# EAGLE board SCH1001-001-009-320 - ALU (EAGLE 9.4.2), part 1 of 4
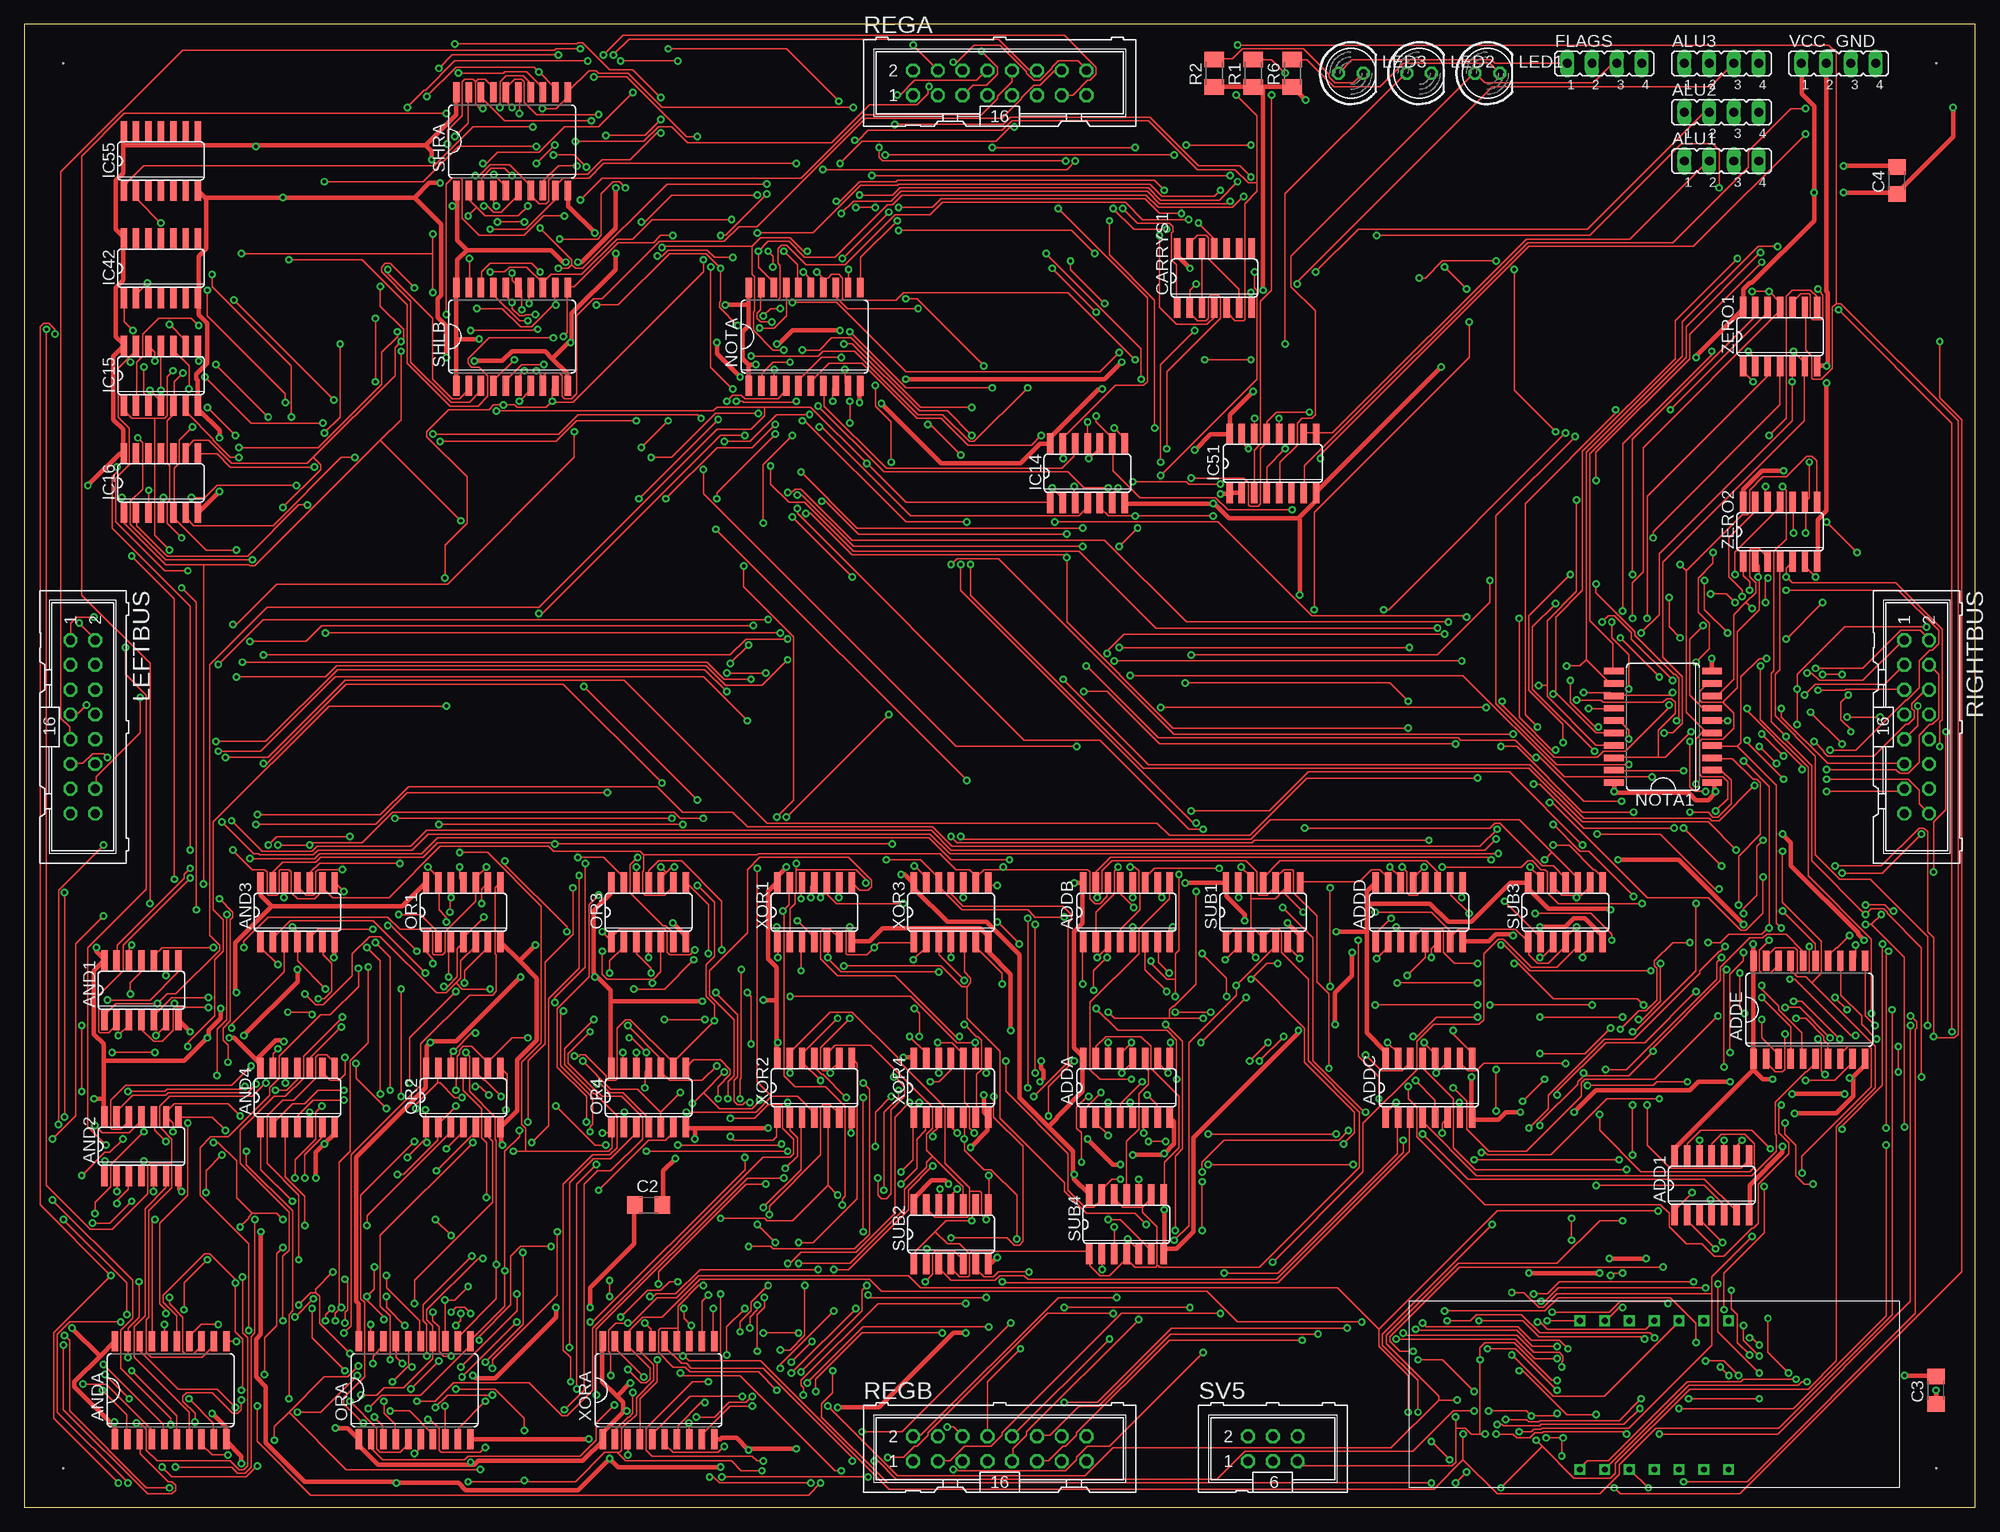
[diagram p5: board, top side]
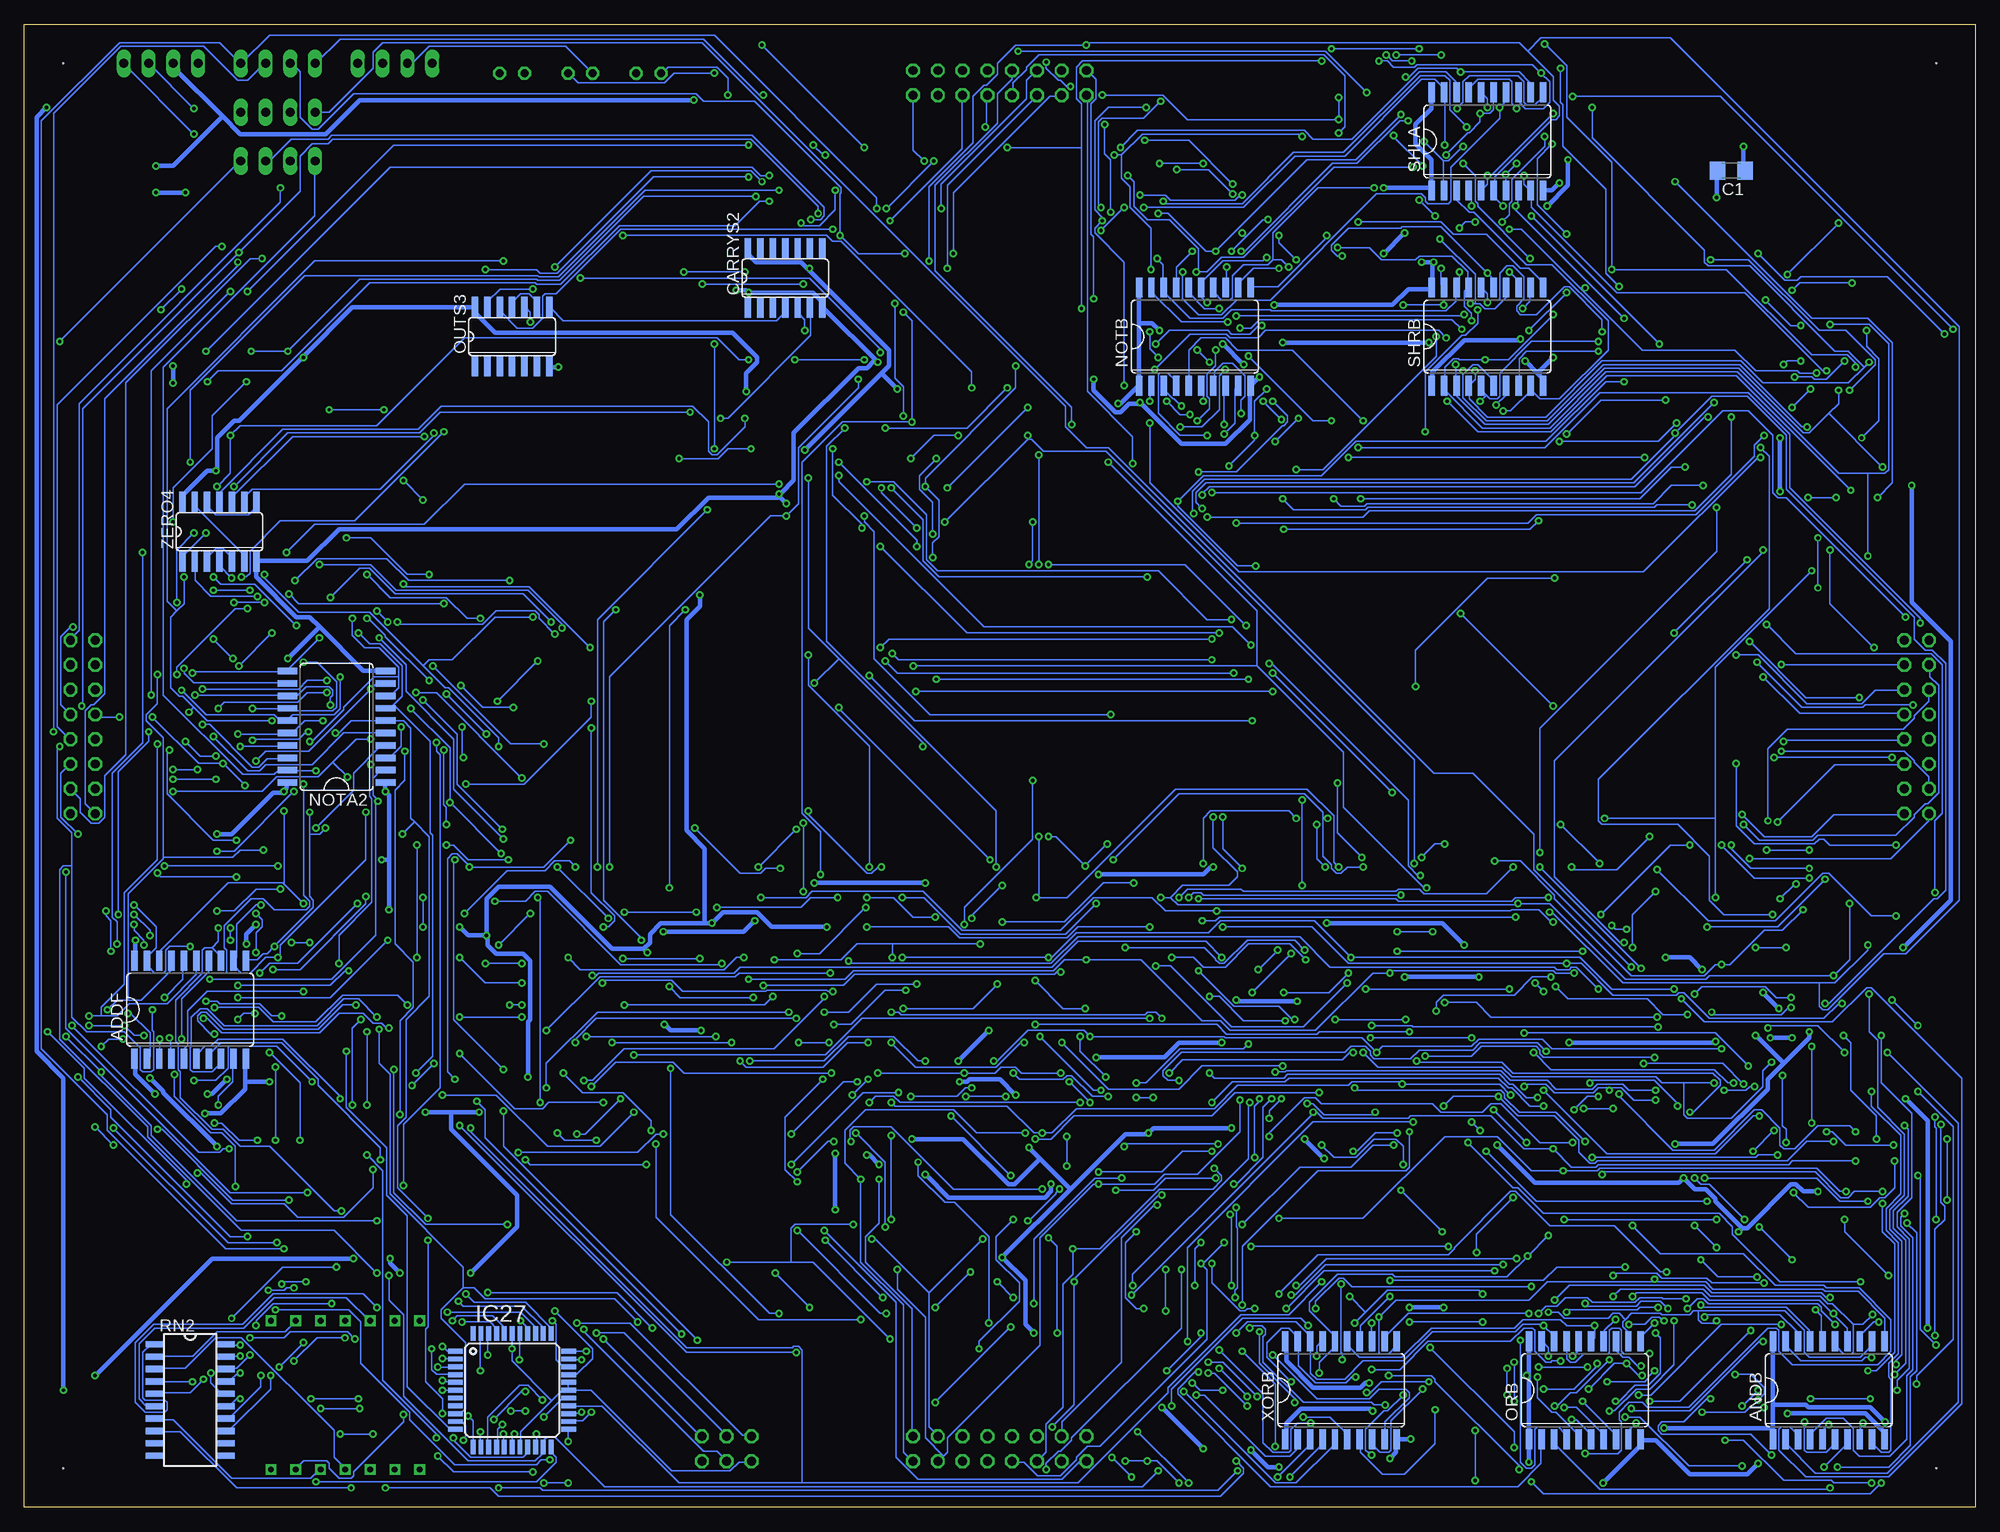
[diagram p6: board, bottom side, seen from below]

Size 200 x 152 mm. Coordinates in mm from the lower left corner, seen from the top.
Outline: 0,0 200,0 200,152 0,152 0,0
Copper layers (1*16): Top 0.035mm / dielectric 1.5mm / Bottom 0.035mm
Design rules "default *": minimum track width 6mil, minimum drill 0.35mm, track to track 6mil, track to pad 6mil, pad to pad 6mil, via to via 6mil, smd to smd 6mil, copper to edge 40mil, drill to drill 6mil, minimum pad ring 10mil, minimum via ring 8mil, stop-mask expansion 4mil, vias tented up to drill 0mil, thermal gap 10mil
Net classes: 1 power: width 0.457 mm
Holes 0.12 mm at 4,4 196,148 4,148 196,4

## Footprints (pad centres in the part's own frame; a part is rotated, then mirrored left to right if it is on the bottom)
SO14 = smd 0.66 x 2.032: 1 -3.81,-3.073; 2 -2.54,-3.073; 3 -1.27,-3.073; 4 0,-3.073; 5 1.27,-3.073; 6 2.54,-3.073; 7 3.81,-3.073; 8 3.81,3.073; 9 2.54,3.073; 10 1.27,3.073; 11 0,3.073; 12 -1.27,3.073; 13 -2.54,3.073; 14 -3.81,3.073
SO16 = smd 0.66 x 2.032: 1 -4.445,-3.073; 2 -3.175,-3.073; 3 -1.905,-3.073; 4 -0.635,-3.073; 5 0.635,-3.073; 6 1.905,-3.073; 7 3.175,-3.073; 8 4.445,-3.073; 9 4.445,3.073; 10 3.175,3.073; 11 1.905,3.073; 12 0.635,3.073; 13 -0.635,3.073; 14 -1.905,3.073; 15 -3.175,3.073; 16 -4.445,3.073
SO20W = smd 0.66 x 2.032: 1 -5.715,-5.029; 2 -4.445,-5.029; 3 -3.175,-5.029; 4 -1.905,-5.029; 5 -0.635,-5.029; 6 0.635,-5.029; 7 1.905,-5.029; 8 3.175,-5.029; 9 4.445,-5.029; 10 5.715,-5.029; 11 5.715,5.029; 12 4.445,5.029; 13 3.175,5.029; 14 1.905,5.029; 15 0.635,5.029; 16 -0.635,5.029; 17 -1.905,5.029; 18 -3.175,5.029; 19 -4.445,5.029; 20 -5.715,5.029
JP4 = drill 0.914 long: 1 -3.81,0; 2 -1.27,0; 3 1.27,0; 4 3.81,0
C1206 = smd 1.6 x 1.8: 1 -1.4,0; 2 1.4,0
TQFP44 = smd 1.5 x 0.5: 1 -5.8,4; 2 -5.8,3.2; 3 -5.8,2.4; 4 -5.8,1.6; 5 -5.8,0.8; 6 -5.8,0; 7 -5.8,-0.8; 8 -5.8,-1.6; 9 -5.8,-2.4; 10 -5.8,-3.2; 11 -5.8,-4; 23 5.8,-4; 24 5.8,-3.2; 25 5.8,-2.4; 26 5.8,-1.6; 27 5.8,-0.8; 28 5.8,0; 29 5.8,0.8; 30 5.8,1.6; 31 5.8,2.4; 32 5.8,3.2; 33 5.8,4 | smd 0.5 x 1.5: 12 -4,-5.8; 13 -3.2,-5.8; 14 -2.4,-5.8; 15 -1.6,-5.8; 16 -0.8,-5.8; 17 0,-5.8; 18 0.8,-5.8; 19 1.6,-5.8; 20 2.4,-5.8; 21 3.2,-5.8; 22 4,-5.8; 34 4,5.8; 35 3.2,5.8; 36 2.4,5.8; 37 1.6,5.8; 38 0.8,5.8; 39 0,5.8; 40 -0.8,5.8; 41 -1.6,5.8; 42 -2.4,5.8; 43 -3.2,5.8; 44 -4,5.8
LED5MM = drill 0.813 octagon: A -1.27,0; K 1.27,0
ML16 = drill 0.914 octagon: 1 -8.89,-1.27; 2 -8.89,1.27; 3 -6.35,-1.27; 4 -6.35,1.27; 5 -3.81,-1.27; 6 -3.81,1.27; 7 -1.27,-1.27; 8 -1.27,1.27; 9 1.27,-1.27; 10 1.27,1.27; 11 3.81,-1.27; 12 3.81,1.27; 13 6.35,-1.27; 14 6.35,1.27; 15 8.89,-1.27; 16 8.89,1.27
M1206 = smd 1.6 x 2: 1 -1.4,0; 2 1.4,0
SOMC20 = smd 1.91 x 0.64: 1 -3.62,5.715; 2 -3.62,4.445; 3 -3.62,3.175; 4 -3.62,1.905; 5 -3.62,0.635; 6 -3.62,-0.635; 7 -3.62,-1.905; 8 -3.62,-3.175; 9 -3.62,-4.445; 10 -3.62,-5.715; 11 3.62,-5.715; 12 3.62,-4.445; 13 3.62,-3.175; 14 3.62,-1.905; 15 3.62,-0.635; 16 3.62,0.635; 17 3.62,1.905; 18 3.62,3.175; 19 3.62,4.445; 20 3.62,5.715
ML6 = drill 0.914 octagon: 1 -2.54,-1.27; 2 -2.54,1.27; 3 0,-1.27; 4 0,1.27; 5 2.54,-1.27; 6 2.54,1.27
4-DIGIT-7-SEGMENT = drill 0.6 square: PIN1 17.48,1.88; PIN2 20.02,1.88; PIN3 22.56,1.88; PIN4 25.1,1.88; PIN5 27.64,1.88; PIN6 30.18,1.88; PIN7 32.72,1.88; PIN8 32.72,17.12; PIN9 30.18,17.12; PIN10 27.64,17.12; PIN11 25.1,17.12; PIN12 22.56,17.12; PIN13 20.02,17.12; PIN14 17.48,17.12

## Placement (x,y rotation side)
ADD1  74ALS08D  [SO14]  173,33 0 top
ADDA  74283D  [SO16]  113,43 0 top
ADDB  74283D  [SO16]  113,61 0 top
ADDC  74283D  [SO16]  144,43 0 top
ADDD  74283D  [SO16]  143,61 0 top
ADDE  74AC245DW  [SO20W]  183,51 0 top
ADDF  74AC245DW  [SO20W]  183,51 0 bottom
ALU1  [JP4]  174,138 0 top
ALU2  [JP4]  174,143 0 top
ALU3  [JP4]  174,148 0 top
AND1  74ALS08D  [SO14]  12,53 0 top
AND2  74ALS08D  [SO14]  12,37 0 top
AND3  74ALS08D  [SO14]  28,61 0 top
AND4  74ALS08D  [SO14]  28,42 0 top
ANDA  74AC245DW  [SO20W]  15,12 0 top
ANDB  74AC245DW  [SO20W]  15,12 0 bottom
C1  1uF  [C1206]  25,137 180 bottom
C2  1uF  [C1206]  64,31 0 top
C3  1uF  [C1206]  196,12 90 top
C4  1uF  [C1206]  192,136 90 top
CARRYS1  74ALS08D  [SO14]  122,126 0 top
CARRYS2  74ALS08D  [SO14]  122,126 0 bottom
FLAGS  [JP4]  162,148 0 top
IC14  74ALS04D  [SO14]  109,106 0 top
IC15  74ALS04D  [SO14]  14,116 0 top
IC16  74ALS04D  [SO14]  14,105 0 top
IC27  MEGA8535-A  [TQFP44]  150,12 0 bottom
IC42  74ALS04D  [SO14]  14,127 0 top
IC51  74LS173D  [SO16]  128,107 0 top
IC55  74ALS04D  [SO14]  14,138 0 top
LED1  [LED5MM]  150,147 0 top
LED2  [LED5MM]  143,147 0 top
LED3  [LED5MM]  136,147 0 top
LEFTBUS  [ML16]  6,80 270 top
NOTA  74AC245DW  [SO20W]  80,120 0 top
NOTA1  74AC245DW  [SO20W]  168,80 90 top
NOTA2  74AC245DW  [SO20W]  168,80 90 bottom
NOTB  74AC245DW  [SO20W]  80,120 0 bottom
OR1  74LS32D  [SO14]  45,61 0 top
OR2  74LS32D  [SO14]  45,42 0 top
OR3  74LS32D  [SO14]  64,61 0 top
OR4  74LS32D  [SO14]  64,42 0 top
ORA  74AC245DW  [SO20W]  40,12 0 top
ORB  74AC245DW  [SO20W]  40,12 0 bottom
OUTS3  74LS32D  [SO14]  150,120 0 bottom
R1  [M1206]  126,147 90 top
R2  [M1206]  122,147 90 top
R6  [M1206]  130,147 90 top
REGA  [ML16]  100,146 0 top
REGB  [ML16]  100,6 0 top
RIGHTBUS  [ML16]  194,80 270 top
RN2  [SOMC20]  183,11 0 bottom
SHLA  74AC245DW  [SO20W]  50,140 0 bottom
SHLB  74AC245DW  [SO20W]  50,120 0 top
SHRA  74AC245DW  [SO20W]  50,140 0 top
SHRB  74AC245DW  [SO20W]  50,120 0 bottom
SUB1  74LS86D  [SO14]  127,61 0 top
SUB2  74LS86D  [SO14]  95,28 0 top
SUB3  74LS86D  [SO14]  158,61 0 top
SUB4  74LS86D  [SO14]  113,29 0 top
SV5  [ML6]  128,6 0 top
U$1  4-DIGIT-7-SEGMENT  [4-DIGIT-7-SEGMENT]  142,2 0 top
VCC_GND  [JP4]  186,148 0 top
XOR1  74LS86D  [SO14]  81,61 0 top
XOR2  74LS86D  [SO14]  81,43 0 top
XOR3  74LS86D  [SO14]  95,61 0 top
XOR4  74LS86D  [SO14]  95,43 0 top
XORA  74AC245DW  [SO20W]  65,12 0 top
XORB  74AC245DW  [SO20W]  65,12 0 bottom
ZERO1  74ALS02D  [SO14]  180,120 0 top
ZERO2  74ALS02D  [SO14]  180,100 0 top
ZERO4  74ALS08D  [SO14]  180,100 0 bottom

## Tracks (layer width: path | path; a pad name or v marks a point on that pad's centre or on a via)
!ADD  (via drill 0.35)
  Top 0.152: v173.38,26.5 170.5,29.38 170.5,29.88 ADD1.2 | v112.62,133.12 114.12,131.62 117.38,131.62 117.75,131.25 117.75,130.75 117.62,130.62 117.62,127.88 118.12,127.38 118.12,123 CARRYS1.1
  Bottom 0.152: v173.38,26.5 179.38,26.5 191.5,38.62 191.5,40.25 198.25,47 198.25,142.12 190.25,150.12 180,150.12 177.88,148 ALU3.4 177.75,148 174.88,150.88 129.25,150.88 112.62,134.25 v112.62,133.12
!ALUOUT  (via drill 0.35)
  Top 0.152: v170.12,75.5 163,75.5 NOTA1.19
  Bottom 0.152: v170.12,75.5 173,75.5 NOTA2.19 173.12,75.5 174,75.5 174.38,75.12 177.62,75.12 185.75,83.25 185.75,116.88 170.25,132.38 170.25,138 ALU1.1
!AND  (via drill 0.35)
  Top 0.152: v10.62,15.38 10.62,17 ANDA.19 10.62,17.12 10.62,18.38 11.75,19.5 v11.75,23.12 | ALU2.2 172.25,143 160.25,131 136.75,131 v132.38,126.62 | v126.12,126.62 126.12,125 126.38,124.75 126.38,115.62 v116.5,105.75 | v72.38,86.5 v74.25,88.38 | v56.88,64.75 56.88,55.25 53.75,52.12 53.75,39.12 v52,37.38
  Bottom 0.152: v10.62,15.38 11.25,15.38 11.62,15 17.88,15 19.38,16.5 19.38,17 ANDB.19 | v126.12,126.62 v132.38,126.62 | v116.5,105.75 116.5,105.12 101.62,90.25 76.12,90.25 v74.25,88.38 | v72.38,86.5 72.12,86.5 58.12,72.5 58.12,65.75 57.12,64.75 v56.88,64.75 | v52,37.38 47.38,32.75 46.88,32.75 44.25,30.12 26.25,30.12 24.88,28.75 24.88,28 20,23.12 v11.75,23.12
!FLAG_IN
  Top 0.152: IC51.10 131.25,110.12 132.38,110.12 IC51.9 132.5,110.12 134.12,110.12 154,130 164.62,130 172.62,138 ALU1.2
!NOT  (via drill 0.35)
  Top 0.152: 75.5,123.75 75.5,122.75 75.12,122.38 75.12,121.88 75.5,121.5 v76.62,121.5 | 75.5,123.75 75.5,125 NOTA.19 | v119.38,132 114.62,132 112.88,133.75 94.12,133.75 92.88,132.5 89.25,132.5 84.12,127.38 80.12,127.38 78.12,129.38 77.62,129.38 77.25,129 77.25,127.5 77.5,127.25 77.5,124 77.25,123.75 75.5,123.75
  Bottom 0.152: v76.62,121.5 81.38,121.5 84.38,124.5 84.38,125 NOTB.19 | ALU1.3 174.88,138 172.62,140.25 168.88,140.25 168.5,140.62 125.38,140.62 118,133.25 118,132.38 118.38,132 v119.38,132
!OR  (via drill 0.35)
  Top 0.152: v35.5,18.75 35.5,17.12 ORA.19 | v31.88,19.12 31.88,19.88 v32.5,20.5 32.25,20.75 32.25,35.38 33.38,36.5 33.38,45.75 35.25,47.62 v35.25,55.38 | v41.88,20 41.88,19.12 42.5,18.5 42.5,16 43,15.5 v43.75,15.5
  Bottom 0.152: v35.5,18.75 33.88,18.75 33.12,19.5 32.38,19.5 32,19.12 v31.88,19.12 | v32.5,20.5 34.38,20.5 34.62,20.25 41.62,20.25 v41.88,20 | v43.75,15.5 43.75,16.38 44.38,17 ORB.19 | ALU2.1 168.75,143 164.25,147.5 164.25,149.12 163.25,150.12 130.5,150.12 93.25,112.88 93.25,110.75 91.12,108.62 88.88,108.62 55.5,75.25 51.5,75.25 45.25,69 45.25,65.38 v35.25,55.38
!SHL  (via drill 0.35)
  Top 0.152: v45.62,128 45.62,125.12 SHLB.19 | v54.38,139.62 v52.5,137.75 | CARRYS1.4 122,122 121.25,121.25 118.12,121.25 116.38,123 v116.38,130.38 | v87.25,133.25 v85.25,133.25 | v89.62,130.88 107.38,130.88 v109.75,128.5
  Bottom 0.152: v45.62,128 51,133.38 51,133.62 51.25,133.88 51.25,136.5 v52.5,137.75 | v54.38,139.62 54.38,145 SHLA.19 54.5,145.12 54.5,145.5 55.38,146.38 56.75,146.38 64.62,138.5 69.75,138.5 75,133.25 v85.25,133.25 | ALU3.2 172.62,148 171.75,147.12 171.75,142.5 170.5,141.25 169.88,141.25 166.25,144.88 131.12,144.88 130.38,144.12 125.12,144.12 116.25,135.25 116.25,134.75 116.38,134.62 v116.38,130.38 114.5,128.5 v109.75,128.5 | v89.62,130.88 v87.25,133.25
!SHR  (via drill 0.35)
  Top 0.152: v44.12,140.5 45.5,141.88 45.5,145 SHRA.19 | v51.25,131.75 v48.5,131.75 | v52.88,131.12 56.12,127.88 56.12,127.38 | 56.12,127.38 55.75,127 v54.75,127 | 126.38,135.75 126.38,142.62 v124.25,144.75 | 126.38,135.75 126.38,134.88 125.12,133.62 125.12,121.75 125,121.62 124.12,121.62 123.38,122.38 123.38,122.88 CARRYS1.5 | 56.12,127.38 56.5,127 57.25,127 65.88,135.62 v76.12,135.62 | v85.12,140.12 85.5,140.12 86.5,141.12 100.25,141.12 101.25,142.12 115.25,142.12 120.25,137.12 124.12,137.12 125.5,135.75 126.38,135.75
  Bottom 0.152: v44.12,140.5 44.12,139.5 47.5,136.12 47.5,133.88 47.75,133.62 47.75,132.5 v48.5,131.75 | v51.25,131.75 52.25,131.75 v52.88,131.12 | v54.75,127 54.75,125.38 54.5,125.12 SHRB.19 | v124.25,144.75 124.62,144.75 130.38,150.5 167.62,150.5 170.12,148 ALU3.1 | v76.12,135.62 80.62,140.12 v85.12,140.12
!SUB  (via drill 0.35)
  Top 0.152: v120.12,125.38 119.5,124.75 119.5,123 CARRYS1.2 119.5,122.88 119.5,122.38 120.25,121.62 121.12,121.62 121.38,121.88 121.38,124 121.62,124.25 122.38,124.25 122.62,124 122.62,121.88 117.12,116.38 v117.12,108.5 | v130.5,125.38 130.5,125.62 150.5,145.62 172.88,145.62 175.25,148 ALU3.3 | v171,32.25 169.25,30.5 169.25,30 ADD1.1 | v195.75,65.12 195.75,70.25 197,71.5 v197,79.5 | v11.12,120.62 10.25,121.5 10.25,123.88 IC42.1 | v11.62,109.62 12.12,109.12 12.12,104.38 10.88,103.12 10.88,100.75 14.5,97.12 v23.38,97.12 | v77.5,89.62 v30.88,89.62 | v114.12,100.38 v112.25,98.5
  Bottom 0.152: v130.5,125.38 v120.12,125.38 | v171,32.25 178.88,32.25 195.75,49.12 v195.75,65.12 | v197,79.5 197,142.88 190.12,149.75 181.62,149.75 178.12,146.25 177.12,146.25 175.38,148 ALU3.3 | v11.12,120.62 11.12,119 9.88,117.75 9.88,111.38 v11.62,109.62 | v30.88,89.62 v23.38,97.12 | v77.5,89.62 103.38,89.62 v112.25,98.5 | v114.12,100.38 114.12,100.75 117.12,103.75 v117.12,108.5
!XOR  (via drill 0.35)
  Top 0.152: v63.5,13.38 60.62,16.25 60.62,17 XORA.19 | v196.38,119.5 196.38,113.75 198.62,111.5 198.62,24.12 175.88,1.38 163.62,1.38 v163,2 | v75.75,4.75 75.12,4.75 74.62,5.25 64.38,5.25 63.75,5.88 63.75,8.12 68.5,12.88 v70.12,12.88
  Bottom 0.152: v63.5,13.38 63.88,13.38 64.5,12.75 67.62,12.75 69.38,14.5 69.38,17 XORB.19 69.5,17.12 69.5,17.5 70.38,18.38 71.12,18.38 72.62,16.88 72.62,15.38 v70.12,12.88 | v196.38,119.5 177.88,138 ALU1.4 | v163,2 152.25,2 151.38,1.12 77.38,1.12 75,3.5 75,4 v75.75,4.75
A  (via drill 0.35)
  Top 0.152: v149.12,19.12 153.62,19.12 155.25,17.5 165.88,17.5 v166.12,17.25 | v176.88,17.38 177.12,17.38 v177.88,16.62
  Bottom 0.152: v149.12,19.12 148.5,18.5 148.5,17.88 IC27.37 | v166.12,17.25 166.88,18 172.75,18 173.38,17.38 v176.88,17.38 | v177.88,16.62 179.38,16.62 RN2.20
ADD_CARRY  (via drill 0.35)
  Top 0.152: v117.5,47.62 117.5,46.12 ADDA.9 | v125.25,52.25 v120.62,47.62 | v133.88,63.5 v133.88,53.38 | v132.25,92 132.25,102 148.12,117.88 v148.12,121.5
  Bottom 0.152: v120.62,47.62 v117.5,47.62 | v125.25,52.25 132.75,52.25 v133.88,53.38 | v133.88,63.5 133.88,90.38 v132.25,92 | v148.12,121.5 148.12,122.5 148.62,123 OUTS3.10
B  (via drill 0.35)
  Top 0.152: v156.62,20 162.5,20 163.62,21.12 168.25,21.12 v168.5,20.88 | v176.25,18.62 176.25,17.12 v177.88,15.5
  Bottom 0.152: v156.62,20 149.12,20 147.62,18.5 147.62,17.88 IC27.36 | v168.5,20.88 174.5,20.88 176.25,19.12 v176.25,18.62 | v177.88,15.5 179.38,15.5 RN2.19
BUSOUT0  (via drill 0.35)
  Top 0.152: v21.62,10.25 19.75,12.12 15.75,12.12 11.88,16 11.88,17 ANDA.18 | v28,9.75 30.38,9.75 v34.12,13.5 | v35.75,14.75 35.75,15.5 36.75,16.5 36.75,17 ORA.18 | v137.12,19 124.38,19 121.25,22.12 87.88,22.12 86.62,23.38 69.25,23.38 65.38,19.5 63.38,19.5 61.88,18 61.88,17.12 XORA.18 61.88,17 61.88,16.5 64.12,14.25 64.12,13.12 63.75,12.75 63.25,12.75 v61.88,14.12 | v42.5,15 v39.62,12.12 | v58.12,142.12 49.25,142.12 46.88,144.5 46.88,145 SHRA.18 | NOTA.18 76.75,125.12 76.75,125.62 75.25,127.12 v75.25,128.75 76.25,129.75 78.38,129.75 80,128.12 83.12,128.12 88.5,133.5 89,133.5 90,134.5 115,134.5 116.25,133.25 123.88,133.25 v125,134.38 | v176.25,76.5 178.88,73.88 178.88,59.5 | v178.88,58.12 177.88,57.12 177.88,55 178.12,54.75 179,54.75 179.75,55.5 179.75,56 ADDE.18 | v176.75,118.5 177.38,117.88 177.38,117 ZERO1.2 | v173,118.5 173,118.12 163.88,109 v163.88,91.88 | v162.75,90.75 162.75,89.12 164.5,87.38 v164.5,83.88 | v163.62,49 165.5,50.88 166.25,50.88 167.38,52 167.38,55.25 167.12,55.5 167.12,56 169,57.88 v170.75,57.88 | v172.62,57.88 173.88,57.88 174.75,58.75 178.12,58.75 178.88,59.5 | 178.88,59.5 v178.88,59.38
  Bottom 0.152: v21.62,10.25 23.12,10.25 23.62,9.75 v28,9.75 | v34.12,13.5 34.5,13.5 v35.75,14.75 37,14.75 v39.62,12.12 | 155,22.5 157.25,20.25 157.25,19.38 154.75,16.88 154.75,10.12 155.25,9.62 155.75,9.62 IC27.9 | 155,22.5 153.88,22.5 152.75,21.38 139.5,21.38 v137.12,19 | v42.5,15 43.38,15 43.5,14.88 44,14.88 45.12,16 45.12,18.12 45.38,18.38 46.25,18.38 47.62,17 56.12,17 59,14.12 v61.88,14.12 | v58.12,142.12 59,142.12 63.38,137.75 65.88,137.75 74.88,128.75 v75.25,128.75 | v176.25,76.5 175.25,77.5 170.88,77.5 v164.5,83.88 164,84.38 163,84.38 NOTA2.9 | v178.88,58.12 v178.88,59.38 | v176.75,118.5 v173,118.5 165.62,125.88 147.5,125.88 147.38,125.75 145.12,125.75 136.5,134.38 v125,134.38 | v162.75,90.75 v163.88,91.88 | 155,22.5 155,24.62 162.5,32.12 162.5,44.38 163.62,45.5 v163.62,49 | v172.62,57.88 v170.75,57.88
BUSOUT1  (via drill 0.35)
  Top 0.152: v166.38,91.12 166.38,103.62 178.62,115.88 178.62,116.88 ZERO1.3 | 155.62,6.25 158.88,3 162.62,3 163.12,3.5 163.12,4.5 170.75,12.12 182.88,12.12 185.75,15 185.75,39 189.75,43 189.75,47.25 183.25,53.75 | 155.62,6.25 v155,6.88 | 183.25,53.75 182.62,54.38 181.75,54.38 181.12,55 181.12,56 ADDE.17 | v170.75,78.5 170.75,73.88 171.25,73.38 v172.38,73.38 | v180.25,67.25 180.25,62 184.25,58 184.25,54.75 183.25,53.75 | 46.25,146.12 46.5,146.38 47.25,146.38 48,145.62 48,145.12 SHRA.17 | 46.25,146.12 46.25,143.88 46.75,143.38 v47,143.38 | v75.38,120.88 76.88,120.88 78.12,122.12 78.12,125 NOTA.17 | v52.62,120.75 52.25,120.75 52.12,120.62 v45.75,120.62 | v41.88,130.5 41.88,128.5 | 41.88,128.5 v41.88,124.5 | v43.38,139.75 43.38,141.12 44.88,142.62 44.88,146.12 45.12,146.38 46,146.38 46.25,146.12 | v13.38,29.5 13.12,29.25 13.12,17.12 ANDA.17 | v9.62,2.5 3,9.12 3,17.88 v8.88,23.75 1.62,31 1.62,121 2,121.38 2.5,121.38 3.12,120.75 v3.12,120.25 | 51.25,2.62 56.5,2.62 59.5,5.62 60.75,5.62 | 51.25,2.62 v45.5,2.62 | 60.75,5.62 61,5.62 61.25,5.88 61.25,8.12 62,8.88 62.12,8.88 62.75,9.5 62.75,11.25 64.5,13 64.5,14.62 63.12,16 63.12,17 XORA.17 | v38.75,14.75 38.12,15.38 38.12,17 ORA.17 | v44.25,12.12 48.25,12.12 51.25,9.12 v51.25,7.88 | 51.25,2.62 v51.25,2.75 | v22.25,128.5 41.88,128.5 | v151.38,2 155.62,6.25 | v75.62,3.75 73.5,3.75 72.5,4.75 61.62,4.75 60.75,5.62
  Bottom 0.152: 161.62,85.12 161.62,86.12 163.62,88.12 165.12,88.12 166.38,89.38 v166.38,91.12 | 161.62,85.12 161.62,84 162.38,83.25 162.88,83.25 NOTA2.8 | v155,6.88 154.75,7.12 154.75,8.38 155.12,8.75 155.75,8.75 IC27.10 | 161.62,85.12 164.12,85.12 167.25,82 167.25,81.75 170.5,78.5 v170.75,78.5 | v172.38,73.38 178.5,67.25 v180.25,67.25 | v47,143.38 47.5,143.88 47.5,146.12 47.75,146.38 51,146.38 51.88,145.5 51.88,145.12 SHLA.17 | v75.38,120.88 74.25,120.88 73.38,121.75 53.62,121.75 v52.62,120.75 | v41.88,124.5 v45.75,120.62 | v41.88,130.5 44.88,133.5 44.88,138.25 v43.38,139.75 | v13.38,29.5 13.38,28.25 v8.88,23.75 | v9.62,2.5 10.75,1.38 44.25,1.38 v45.5,2.62 | v38.75,14.75 38.75,14.5 41.12,12.12 v44.25,12.12 | v51.25,2.75 v51.25,7.88 | v22.25,128.5 19.5,125.75 18.25,125.75 17.88,126.12 9,126.12 v3.12,120.25 | v151.38,2 147.12,2 146.88,1.75 77.62,1.75 v75.62,3.75
BUSOUT2  (via drill 0.35)
  Top 0.152: v50,143.5 49.38,144.12 49.38,145 SHRA.16 49.38,145.12 49.38,145.5 50.25,146.38 51,146.38 51.25,146.12 51.25,144 52.5,142.75 v58.88,142.75 | v77.88,128.75 79.25,127.38 79.25,125.12 NOTA.16 | v165.75,89.62 167.62,91.5 167.62,97.75 181.25,111.38 v181.25,115.38 181.25,116.88 ZERO1.5 | v83.75,132.62 85,133.88 88.88,133.88 89.88,134.88 115.12,134.88 116.38,133.62 123.38,133.62 v123.62,133.88 | v14.38,18.75 14.38,17.12 ANDA.16 | v29.5,20.38 29.5,17.38 v32.88,14 | 39.25,14.38 39.38,14.5 39.38,17 ORA.16 | 39.25,14.38 v37.75,12.88 | v63.62,18.88 64.25,18.25 64.25,17.12 XORA.16 | v50.5,21.88 50.5,20.12 v44.75,14.38 | 39.25,14.38 v39.75,14.38 | ADDE.16 182.25,56.12 182.25,57.12 180.62,58.75 178.62,58.75 178.25,58.38 176.88,58.38 173.88,55.38 173.88,54 167,47.12 v167,46.75 164.5,44.25 159.88,44.25 | v64.12,21.62 64.5,21.62 64.75,21.88 66.75,21.88 69.25,24.38 v81.38,24.38 | v95.25,3.88 95.62,3.88 95.75,3.75 106.75,3.75 107.88,4.88 107.88,5.12 109,6.25 111.25,6.25 v120.88,15.88 | v155.38,39.12 155.38,39.5 159.25,43.38 159.25,43.62 159.88,44.25 | 159.88,44.25 v159.88,44.5
  Bottom 0.152: v50,143.5 50,144.38 50.62,145 SHLA.16 | v58.88,142.75 63.5,138.12 68.5,138.12 v77.88,128.75 78.88,128.75 82.75,132.62 v83.75,132.62 | 162.12,82.25 161.25,83.12 161.25,86.25 163.5,88.5 164.62,88.5 v165.75,89.62 | 162.12,82.25 162.38,82 162.88,82 NOTA2.7 | v123.62,133.88 124.62,133.88 127.12,131.38 139,131.38 145,125.38 147.5,125.38 147.62,125.5 164.62,125.5 173.62,116.5 180.12,116.5 v181.25,115.38 | v14.38,18.75 15.75,20.12 15.75,20.5 16.12,20.88 27.38,20.88 27.88,21.38 28.5,21.38 v29.5,20.38 | v32.88,14 33.5,13.38 33.5,13.25 33.88,12.88 v37.75,12.88 | 62.5,20 60.25,22.25 50.88,22.25 v50.5,21.88 | 62.5,20 v63.62,18.88 | v39.75,14.38 v44.75,14.38 | IC27.11 156.38,8 160.75,12.38 160.75,29.88 162.88,32 162.88,36.88 167,41 v167,46.75 | v64.12,21.62 62.5,20 | v81.38,24.38 81.38,18.38 92.62,7.12 92.62,6.88 93.75,5.75 94,5.75 95.25,4.5 v95.25,3.88 | v120.88,15.88 132.12,15.88 v155.38,39.12 | 162.12,82.25 158.38,78.5 158.38,69.12 158.12,68.88 158.12,46.25 v159.88,44.5
BUSOUT3  (via drill 0.35)
  Top 0.152: v50.75,142.88 50.75,145 SHRA.15 | v79.88,126.62 80.62,125.88 80.62,125.12 NOTA.15 | v57.62,137.38 56.38,138.62 v54.25,138.62 | v37.12,23.75 37.12,22.5 40.5,19.12 40.5,17.25 40.62,17.12 ORA.15 | ANDA.15 15.62,17.12 15.62,19.62 14.25,21 14.25,21.75 18.5,26 19,26 21.62,23.38 v21.62,23 21.62,18 22.38,17.25 22.38,12.12 v22.25,12 | v157.12,9.62 156.88,9.38 v154.5,9.38 154,9.88 v150.12,9.88 | v158.62,29.62 v158.62,27.38 | v84.88,4.75 84.88,5.12 75.75,14.25 68.38,14.25 67.88,14.75 67.38,14.75 65.75,16.38 65.75,17 XORA.15 | v87.12,4.75 87.5,4.75 89.38,2.88 122.25,2.88 125.12,5.75 142.38,5.75 146.5,9.88 v148.62,9.88 | v180.25,61.12 183.62,57.75 183.62,56.12 ADDE.15 | v173.75,63.38 173.38,63.38 167.75,69 v161.25,69 | v168.12,79.38 169,79.38 170,80.38 170,85.12 168,87.12 168,96.88 182.5,111.38 182.5,116.88 ZERO1.6 182.5,117 182.5,117.38 v181.38,118.5 | v23.88,10.38 23.88,6.75 29.38,1.25 80.38,1.25 v81.62,2.5 | v123.62,136.5 v86.88,136.5
  Bottom 0.152: SHLA.15 49.38,145 49.38,143.25 49.75,142.88 v50.75,142.88 50.75,142 51.88,140.88 52,140.88 v54.25,138.62 | 79.62,126.62 78.75,126.62 77.25,128.12 75,128.12 65.75,137.38 v57.62,137.38 | v21.62,23 27,23 27.5,23.5 32.12,23.5 32.62,24 36.88,24 v37.12,23.75 | IC27.12 154,8.88 v154.5,9.38 | v157.12,9.62 157.12,11.12 158.88,12.88 158.88,18.25 158.62,18.5 v158.62,27.38 | v158.62,29.62 161.75,32.75 161.75,39.12 160.88,40 160.88,50 158.5,52.38 158.5,68.75 160,70.25 | 160,70.25 160.38,70.62 160.38,79.88 161.12,80.62 162.88,80.62 NOTA2.6 163,80.62 166.5,80.62 167.75,79.38 v168.12,79.38 | v87.12,4.75 v84.88,4.75 83.88,4.75 v81.62,2.5 | v150.12,9.88 v148.62,9.88 | v180.25,61.12 178.5,61.12 176.25,63.38 v173.75,63.38 | 160,70.25 v161.25,69 | v23.88,10.38 v22.25,12 | 79.62,126.62 79.62,129 82.62,132 84.88,132 86.25,133.38 86.25,135.88 v86.88,136.5 | v123.62,136.5 124.5,136.5 125.38,137.38 162.5,137.38 v181.38,118.5 | 79.62,126.62 v79.88,126.62
BUSOUT4  (via drill 0.35)
  Top 0.152: v19.88,18.75 18.12,18.75 17,17.62 17,17.12 ANDA.14 | v34.5,11.5 36.12,11.5 36.88,12.25 38.88,12.25 41.88,15.25 41.88,17 ORA.14 41.88,17.12 41.88,18.62 41.25,19.25 41.25,20.25 46.5,25.5 v47,25.5 | 67,18.38 67,20.62 69.12,22.75 v69.62,22.75 | 67,18.38 67,17.12 XORA.14 | v48.75,143.5 48.75,146.12 49.38,146.75 51.12,146.75 51.88,146 51.88,145.12 SHRA.14 | 81.88,126 81.88,125.12 NOTA.14 81.88,126 | v81.25,126.62 81.88,126 | v153.25,7.75 154.5,7.75 154.75,8 155.5,8 155.62,8.12 164.5,8.12 173,16.62 173,21.88 | 173,21.88 173,23.62 v177.12,27.75 | v194.5,44.12 194.5,57.38 191,60.88 191,61 190.62,61.38 189.38,61.38 v188.75,60.75 183.25,66.25 183.25,76 180.62,78.62 v180.62,79 179.12,80.5 179.12,85.5 179.38,85.75 179.38,98 180.62,99.25 180.62,104.25 v180.25,104.62 | v187.12,58.62 185.88,57.38 185.75,57.38 185,56.62 185,56.12 ADDE.14 | v178.88,109.88 180.62,111.62 180.62,124.12 181.25,124.75 183.12,124.75 183.75,124.12 183.75,123.12 ZERO1.8 | 81.88,126 82.38,126 82.75,126.38 83.5,126.38 83.88,126 83.88,123.88 84,123.75 89.38,123.75 90.12,124.5 107,124.5 v113.88,117.62 | v125.75,117.62 v121,117.62 | 67,18.38 65.25,18.38 65,18.12 65,15.88 66.5,14.38 67.75,14.38 68.25,13.88 75.25,13.88 v77.12,12 | v80.25,12.75 86,18.5 v98.88,18.5 | v106.62,10.75 110,10.75 117.62,18.38 v135.62,18.38 | v152.5,22 153.75,22 155.25,20.5 155.75,20.5 157.12,21.88 173,21.88
  Bottom 0.152: v19.88,18.75 26,18.75 33.25,11.5 v34.5,11.5 | v69.62,22.75 69.25,22.75 66.5,25.5 v47,25.5 | SHLA.14 48.12,145 48.12,144.12 v48.75,143.5 48.75,142.38 53.75,137.38 53.75,133.88 54,133.62 56.12,133.62 56.38,133.88 56.38,134.25 56.75,134.62 61.38,134.62 72.25,123.75 75.75,123.75 77.25,122.25 79.62,122.25 81.25,123.88 v81.25,126.62 | v153.25,7.75 153.25,6.25 IC27.13 | v177.12,27.75 178.88,27.75 191.12,40 191.12,40.75 v194.5,44.12 | v188.75,60.75 187.12,59.12 v187.12,58.62 | v180.62,79 177.12,75.5 175.88,75.5 175.25,76.12 170.5,76.12 167.25,79.38 163,79.38 NOTA2.5 | v180.25,104.62 178.88,106 v178.88,109.88 177.88,110.88 163.88,110.88 154.88,119.88 129,119.88 126.75,117.62 v125.75,117.62 | v121,117.62 v113.88,117.62 | v77.12,12 79.5,12 v80.25,12.75 | v106.62,10.75 v98.88,18.5 | v135.62,18.38 139.25,22 v152.5,22
BUSOUT5  (via drill 0.35)
  Top 0.152: v44.5,147 49.12,147 49.25,147.12 51.5,147.12 53.12,145.5 53.12,145.12 SHRA.13 | v91.62,122.88 84.38,122.88 83.25,124 83.25,125 NOTA.13 | v61.12,148.25 v67,148.25 | v14.88,21.5 14.88,20.88 16.25,19.5 16.25,16 16.5,15.75 17.38,15.75 18.12,16.5 18.12,17 ANDA.13 | ORA.13 43.12,17.12 v43.12,21.25 44.12,21.25 v45.5,22.62 | 145,11 v146.88,11 | 145,11 140.12,6.12 111.62,6.12 108.75,3.25 89.5,3.25 v82.38,10.38 | XORA.13 68.25,17.12 68.38,17.25 v68.38,18.62 67.62,19.38 v67.62,20.38 | v189.88,48 188.38,49.5 188.38,50.38 186.25,52.5 186.25,56 ADDE.13 | v192.12,44.62 v192.12,47.25 | v163.88,29.38 161.5,29.38 157.12,25 147,25 139.62,17.62 139.62,16.75 145,11.38 145,11 | v174,65.75 v170.12,69.62 | v185.62,65.75 190.38,65.75 194.25,69.62 194.75,69.62 195.12,69.25 195.12,59 195.75,58.38 v195.75,48.25 195.88,48.12 197.88,48.12 198.25,48.5 198.25,111.38 186.25,123.38 185.75,123.38 | 185.75,123.38 185.38,123 185.38,116.75 184.25,115.62 183.38,115.62 183.25,115.75 183.25,118 182.62,118.62 182.62,123 ZERO1.9 | v113.88,139.38 v99.25,139.38 | v124.38,149.88 185,149.88 185.75,149.12 185.75,123.38
  Bottom 0.152: SHLA.13 46.75,145 46.75,144 46.12,143.38 44.25,143.38 43.62,144 43.62,146.12 v44.5,147 45.38,147.88 57.25,147.88 57.5,147.62 59.62,147.62 60.25,148.25 v61.12,148.25 | 91.62,139.38 91.62,143.88 92.12,144.38 92.12,147.62 91.5,148.25 v67,148.25 | 91.62,139.38 v91.62,122.88 | v14.88,21.5 15.25,21.5 15.75,22 27,22 27.75,22.75 41.62,22.75 v43.12,21.25 | v146.88,11 148.38,12.5 149.25,12.5 152.5,9.25 152.5,6.25 IC27.14 | v82.38,10.38 82.38,12.12 75.12,19.38 69.12,19.38 v68.38,18.62 | v189.88,48 191.38,48 v192.12,47.25 | v163.88,29.38 178.25,29.38 187,38.12 187,39.12 192.12,44.25 v192.12,44.62 v195.75,48.25 | v170.12,69.62 166.25,73.5 166.25,75.25 163.5,78 163,78 NOTA2.4 | v185.62,65.75 v174,65.75 | v45.5,22.62 63.88,22.62 64.75,23.5 65.25,23.5 67.62,21.12 v67.62,20.38 | v99.25,139.38 91.62,139.38 | v124.38,149.88 v113.88,139.38
BUSOUT6  (via drill 0.35)
  Top 0.152: v151,8.5 151.5,8.5 151.62,8.38 155.38,8.38 155.5,8.5 164,8.5 v165.62,10.12 | v169.62,10.12 181.38,10.12 190.88,19.62 v190.88,37.12 | v192.75,39 192.75,56.38 189.38,59.75 | v188.75,59.75 189.38,59.75 | v187.75,57.62 187.75,56.38 187.5,56.12 ADDE.12 | 15.12,35.25 15.12,37.75 13.88,39 13.88,41.12 14.88,42.12 23.38,42.12 v24.75,43.5 | 15.12,35.25 15.12,32.75 12.75,30.38 12.75,19.5 12.5,19.25 12.5,15.88 13,15.38 18.25,15.38 19.38,16.5 19.38,17 ANDA.12 | v45.25,46.62 45.62,46.25 45.62,42.62 48.25,40 48.25,37.75 48.38,37.62 v48.38,24.88 48.38,21.38 44.5,17.5 44.5,17.12 ORA.12 | v70.12,21.75 69.5,21.12 69.5,17.12 XORA.12 | SHRA.12 54.38,145.12 54.38,145.5 v52.75,147.12 52.25,147.62 44.25,147.62 v41.25,144.62 | v84.5,126.88 84.5,125.12 NOTA.12 | v69,140.5 67.88,140.5 61.75,146.62 v58.38,146.62 | v161.38,80 161,80 158.5,82.5 v158.5,84.75 | v164.88,91.12 164.88,94.75 166,95.88 166,108.62 180,122.62 ZERO1.11 180,123.5 v178.88,124.62 v177.12,124.62 | v117.88,138.62 v88.25,138.62 | v125.75,139.62 v119.12,139.62 | 15.12,35.25 12.88,35.25 12.62,35 12.62,32.12 9,28.5 6.75,28.5 2.25,33 v2.25,120.75 | v190.38,60.75 189.38,59.75 | v187.25,79.5 187.25,79.75 186.25,80.75 186.25,82.5 v187,83.25
  Bottom 0.152: v151,8.5 151.5,8 151.5,6.25 IC27.15 | v169.62,10.12 v165.62,10.12 | v192.75,39 v190.88,37.12 | v188.75,59.75 188.75,59.12 187.75,58.12 v187.75,57.62 | v24.75,43.5 25.38,43.5 26.75,44.88 43.5,44.88 v45.25,46.62 | v70.12,21.75 69.75,21.75 66.62,24.88 v48.38,24.88 | SHLA.12 45.62,145.12 45.62,146 46.75,147.12 v52.75,147.12 53.12,147.5 57.12,147.5 58,146.62 v58.38,146.62 | v84.5,126.88 84.5,131.12 86.62,133.25 86.62,135.38 87.5,136.25 87.5,138.62 | 87.5,138.62 85.38,140.75 69.25,140.75 v69,140.5 | v161.38,80 161.38,78 162.5,76.88 162.88,76.88 NOTA2.3 | v158.5,84.75 163,89.25 163,89.38 164.75,91.12 v164.88,91.12 | v88.25,138.62 87.5,138.62 | v117.88,138.62 118.12,138.62 v119.12,139.62 | v125.75,139.62 162.12,139.62 v177.12,124.62 | v2.25,120.75 26.12,144.62 v41.25,144.62 | v190.38,60.75 190.38,75.38 187.25,78.5 v187.25,79.5 | v187,83.25 187,116.5 v178.88,124.62
BUSOUT7  (via drill 0.35)
  Top 0.152: v150.88,7.5 152.62,7.5 153,7.12 154.38,7.12 154.88,7.62 155.62,7.62 155.75,7.75 164,7.75 v164.25,7.5 | v167.62,7.5 179.75,7.5 193.38,21.12 v193.38,49.38 | v189.75,49.38 188.75,50.38 188.75,56 ADDE.11 | v181,54.12 181.5,54.12 187.25,48.38 v187.75,48.38 | v168.75,112.5 178.62,122.38 178.62,123 ZERO1.12 | v163.12,112.5 163.12,112.12 153.88,102.88 153.88,81.25 v155.12,80 | v163.75,72.38 159.88,72.38 155.38,76.88 v155,76.88 154.62,76.88 152.88,78.62 147.25,78.62 147,78.88 116.25,78.88 v108.88,86.25 | v21.75,17 20.75,17 ANDA.11 | v35.25,10.12 36.62,11.5 40.62,11.5 45.62,16.5 45.62,17 ORA.11 45.75,17.12 49.25,20.62 v49.25,24.25 49.25,36.5 50.75,38 v50.75,38.62 | v70.62,20.38 70.62,17.12 XORA.11 | v53.12,143.38 54.5,143.38 55.62,144.5 55.62,145 SHRA.11 55.75,145.12 57.88,147.25 58.62,147.25 58.88,147 61.88,147 65.38,143.5 v85,143.5 | v89.5,131.88 85.75,128.12 85.75,125.12 NOTA.11 | v51.62,39.5 51.62,45.75 53.38,47.5 53.38,55.88 56.25,58.75 v56.25,63.5 | v88.88,107.12 88.88,111.25 87.25,112.88 v87.25,115
  Bottom 0.152: v150.88,7.5 150.88,6.25 IC27.16 | v167.62,7.5 v164.25,7.5 | v193.38,49.38 v189.75,49.38 188.75,48.38 v187.75,48.38 | 164,72.38 164,58.62 168.5,54.12 v181,54.12 | 164,72.38 164,72.75 164.25,73 164.25,74.75 163.5,75.5 163,75.5 NOTA2.2 | v163.12,112.5 v168.75,112.5 | v155.12,80 155.12,77 v155,76.88 | 164,72.38 v163.75,72.38 | v21.75,17 22.12,17 29.25,9.88 35,9.88 v35.25,10.12 | v70.62,20.38 66.75,24.25 v49.25,24.25 | v53.12,143.38 52.5,144 52.5,146.12 51.88,146.75 46.88,146.75 46.25,146.12 46.25,144 46,143.75 45.12,143.75 44.38,144.5 44.38,145 SHLA.11 | v85,143.5 88.88,143.5 90.25,142.12 90.25,133 89.5,132.25 v89.5,131.88 90.25,131.12 90.25,130.62 87.25,127.62 v87.25,115 | v51.62,39.5 v50.75,38.62 | v56.25,63.5 56.5,63.5 64.75,71.75 64.75,77.38 73.62,86.25 | 73.62,86.25 73.62,91.88 v88.88,107.12 | 73.62,86.25 v108.88,86.25
BUSOUT8  (via drill 0.35)
  Top 0.152: v29.62,21.38 v27.75,19.5 | v44.75,19.88 44.75,19.12 v44.25,18.62 | v52.88,126.62 52,127.5 47.75,127.5 46.88,126.62 46.88,125.12 SHLB.18 | 174.12,82.5 172,82.5 171.75,82.75 171.75,83.62 172.5,84.38 173,84.38 NOTA1.9 | 174.12,82.5 175.62,84 175.62,89.75 177.88,92 177.88,95.38 | 177.88,95.38 177.88,96.5 177.5,96.88 ZERO2.2 | 157.62,7.12 v156,7.12 | v164.88,41.25 v164.88,36.12 | v164.88,48.75 165.12,48.75 171.38,55 v171.38,61.88 | 174.12,82.5 175.25,81.38 175.25,79.88 174.12,78.75 172,78.75 171.75,78.5 171.75,75.12 172,74.88 174.12,74.88 174.62,74.38 174.62,72.62 v173.38,71.38 | v88.62,132.75 v83.88,128 | v89.25,141.75 100.38,141.75 101.12,142.5 115.38,142.5 120.38,137.5 124.62,137.5 v125.75,136.38 | v152.75,126.88 152.75,114.5 v157,110.25 | 177.88,95.38 v177.75,95.38 | v79.38,17.88 v75.75,17.88 | v82.88,14 82.88,11.75 81.75,10.62 81.75,9.25 88.5,2.5 v144.25,2.5 | v147.88,3.62 v146.75,2.5 | 157.62,7.12 v157.62,5.25 | 157.62,7.12 v157.75,7.12
  Bottom 0.152: v27.75,19.5 27.5,19.75 20,19.75 18.25,18 18.25,17.12 ANDB.18 | v29.62,21.38 32,21.38 32.12,21.5 34.38,21.5 34.88,21 39.25,21 39.75,21.5 42,21.5 42.88,20.62 44,20.62 v44.75,19.88 | ORB.18 43.25,17.12 43.25,17.62 v44.25,18.62 44.38,18.75 46.38,18.75 47.12,18 55.62,18 58.62,15 62.75,15 64.62,13.12 67.5,13.12 68.12,13.75 68.12,17 XORB.18 68.25,17.12 68.25,17.62 69.62,19 74.62,19 v75.75,17.88 | v52.88,126.62 52.88,125.38 53.12,125.12 SHRB.18 53.25,125 53.25,123.62 54.25,122.62 72.12,122.62 72.25,122.75 76.25,122.75 77.12,121.88 80.5,121.88 83.12,124.5 83.12,125 NOTB.18 83.25,125.12 83.25,127.38 v83.88,128 | v156,7.12 156,6.88 154.25,5.12 148.88,5.12 148.5,5.5 148.5,6.12 IC27.19 | v157.75,7.12 157.75,7.5 163.25,13 163.25,34.5 v164.88,36.12 | v164.88,48.75 v164.88,41.25 | 173.38,63.88 173.5,64 179.12,64 186.12,57 186.12,56.12 ADDF.18 | 173.38,63.88 v171.38,61.88 | 173.38,63.88 v173.38,71.38 | v88.62,132.75 88.62,138.12 89.25,138.75 v89.25,141.75 | v125.75,136.38 135.5,136.38 145.38,126.5 147.12,126.5 147.5,126.88 v152.75,126.88 | v157,110.25 166.12,101.12 173.75,101.12 176.88,98 176.88,95.75 177.25,95.38 v177.75,95.38 | v79.38,17.88 79.38,17.5 v82.88,14 | v146.75,2.5 v144.25,2.5 | v147.88,3.62 156,3.62 v157.62,5.25
BUSOUT9  (via drill 0.35)
  Top 0.152: v51.62,121.62 50.75,121.62 48.12,124.25 48.12,125 SHLB.17 | v80.25,128.75 79.88,128.75 78.5,130.12 75.5,130.12 74.62,129.25 | 74.62,129.25 65.5,129.25 v65.38,129.12 | v28.12,20.75 29.38,22 29.88,22 | 29.88,22 30.25,21.62 30.25,18.88 v33.38,15.75 | 176.5,92.75 177.5,93.75 177.5,94.75 176.88,95.38 176.88,98.12 177,98.25 177.88,98.25 178.62,97.5 178.62,97 ZERO2.3 | 176.5,92.75 175.25,91.5 175.25,84.88 173.62,83.25 173.12,83.25 NOTA1.8 | 147.5,4.88 v147.5,7.5 | 147.5,4.88 144.5,1.88 88.62,1.88 75.5,15 71.38,15 | 71.38,15 68.12,15 67.62,15.5 v67.5,15.5 | v191.5,51 191.5,19.75 179.88,8.12 167.25,8.12 163.5,4.38 163.5,3.38 161.5,1.38 151,1.38 147.5,4.88 | v177.12,92.12 176.5,92.75 | v186.38,85.38 v184.38,85.38 | 29.88,22 29.88,22.38 v31.62,24.12 | 71.38,15 v71.38,21.88 | 74.62,129.25 74.62,126.38 74.88,126.12 74.88,122.62 74.75,122.5 74.75,120.62 76.75,118.62 v77.88,118.62 | v79.75,111.38 80,111.38 90.38,101 v96.62,101 | v97,96.62 97,93.5 114.75,75.75 154.25,75.75 159.75,70.25 172.62,70.25 v175.5,67.38
  Bottom 0.152: v51.62,121.62 51.62,122.38 52.38,123.12 52.38,124.62 52,125 SHRB.17 52,125.12 52,126.62 53.62,128.25 57,128.25 57.38,127.88 60.88,127.88 62.12,129.12 v65.38,129.12 | v80.25,128.75 81.88,127.12 81.88,125.12 NOTB.17 | v28.12,20.75 27.88,20.5 19.38,20.5 17,18.12 17,17.12 ANDB.17 | v33.38,15.75 36,15.75 36.25,16 36.25,18.12 36.5,18.38 37.25,18.38 37.5,18.12 37.5,15.88 37.62,15.75 40.12,15.75 41,14.88 41.5,14.88 41.88,15.25 41.88,17 ORB.17 | v147.5,7.5 147.5,6.25 IC27.20 | v67.5,15.5 67.5,16.5 67,17 XORB.17 | 189.38,52 190.5,52 v191.5,51 | 189.38,52 188,52 185,55 185,56 ADDF.17 | v177.12,92.12 178.38,92.12 184.38,86.12 v184.38,85.38 | v186.38,85.38 186.38,82.38 187.5,81.25 187.5,80.62 185.75,78.88 185.75,66.62 | 185.75,66.62 185.75,66.5 189.38,62.88 189.38,52 | v31.62,24.12 32.25,24.12 37,28.88 43.62,28.88 47.12,32.38 47.62,32.38 53.38,26.62 53.38,26.5 54,25.88 67.38,25.88 v71.38,21.88 | v77.88,118.62 77.88,117 78.75,116.12 78.75,113.88 78.5,113.62 78.5,112.62 v79.75,111.38 | v96.62,101 96.62,97 v97,96.62 | v175.5,67.38 177.88,67.38 178.62,66.62 185.75,66.62
BUSOUT10  (via drill 0.35)
  Top 0.152: v172.12,90.38 170.75,89 170.75,83.25 172,82 173,82 NOTA1.7 | ZERO2.5 181.25,96.88 180.62,96.25 v180.62,95.38 181.25,94.75 191.88,94.75 196.62,90 196.62,80.75 196.38,80.5 v196.38,78 | v186.88,51 v185.62,52.25 | SHLB.16 49.38,125 49.38,124.12 v50,123.5 50,122.88 50.75,122.12 51.25,122.12 51.38,122.25 v52.38,122.25 | v77.5,122.88 76.5,122.88 v75.75,122.12 | v83.75,3.75 83.12,3.75 73.38,13.5 67.5,13.5 v67.25,13.75 | v16.38,20.25 16.38,23 v18.75,25.38 | v22.12,28.75 23,29.62 23,29.75 23.38,30.12 | 23.38,30.12 25.88,30.12 v26.5,29.5 | v43.75,27.88 v42.12,29.5 | v41.25,15.5 41.25,18.75 40.88,19.12 40.88,20.75 v45.88,25.75 | v38.25,120.5 38.25,120 36.62,118.38 36.62,115.12 30.12,108.62 v22,108.62 | v20.75,60.75 20.75,50 19.75,49 v19.75,44.25 | v19.38,37.38 19.88,37.38 21.75,35.5 21.75,31.75 23.38,30.12 | v163.88,24 162.88,24 v162.62,23.75
  Bottom 0.152: v172.12,90.38 176.38,94.62 179.88,94.62 v180.62,95.38 | v185.62,52.25 183.75,54.12 183.75,56 ADDF.16 | v186.88,51 186.88,48.88 186.75,48.75 186.75,44.88 187,44.62 187.88,44.62 188.12,44.88 188.12,47.12 189.75,48.75 193.62,48.75 195.12,50.25 195.12,65.75 | 195.12,65.75 195.12,69.12 196.62,70.62 196.62,77.75 v196.38,78 | 50,123.75 50,124.38 50.62,125 SHRB.16 | v77.5,122.88 79,122.88 80.62,124.5 80.62,125 NOTB.16 | v75.75,122.12 52.5,122.12 v52.38,122.25 | v83.75,3.75 85.38,2.12 140.5,2.12 145.62,7.25 146.38,7.25 146.75,6.88 146.75,6.25 IC27.21 146.88,6.12 146.88,5.5 147.62,4.75 154.5,4.75 161.12,11.38 161.12,19.75 162.62,21.25 v162.62,23.75 | v67.25,13.75 67.25,14.88 65.75,16.38 65.75,17 XORB.16 65.75,17.12 65.75,17.62 68.25,20.12 68.25,21 65.38,23.88 59.75,23.88 59.5,23.62 48,23.62 v45.88,25.75 v43.75,27.88 | v16.38,20.25 15.75,19.62 15.75,17.12 ANDB.16 | v22.12,28.75 v18.75,25.38 | v42.12,29.5 v26.5,29.5 | v41.25,15.5 40.75,16 40.75,17 ORB.16 | 50,123.75 48.88,123.75 48.75,123.88 48.75,126.5 48,127.25 47.38,127.25 46.25,126.12 46.25,123.88 47,123.12 47,122.62 46.62,122.25 45,122.25 42.12,125.12 41.62,125.12 38.25,121.75 v38.25,120.5 | v22,108.62 21.12,107.75 21.12,92.12 38.62,74.62 38.62,70.38 38.25,70 30.5,70 27.25,66.75 27.25,62.25 25.75,60.75 v20.75,60.75 | v19.75,44.25 19.75,39.12 19.38,38.75 v19.38,37.38 | 50,123.75 v50,123.5 | 195.12,65.75 196,65.75 196.38,65.38 196.38,48 187.38,39 187.38,38 177.75,28.38 168.25,28.38 v163.88,24
BUSOUT11  (via drill 0.35)
  Top 0.152: v37.12,21.62 37.12,20.5 v39,18.62 | v50,126.5 50,125.75 50.62,125.12 SHLB.15 50.75,125 51,124.75 v51,122.75 | v72.62,128.12 70.75,128.12 70,128.88 66,128.88 65.38,128.25 v64.88,128.25 | v174.62,80.62 173.12,80.62 NOTA1.6 | v183.62,95.38 182.62,96.38 182.62,96.88 ZERO2.6 | v170.12,2.62 176.62,2.62 193.88,19.88 193.88,49 194,49.12 194,49.75 v193.38,50.38 | v186.38,78.25 v183.12,81.5 | v78.75,123.5 83.25,123.5 90.38,116.38 110.25,116.38 v112.25,118.38 | v143,126 143.62,126 145.38,127.75 v150.88,127.75 | v10.5,19.75 10.5,23 v4,29.5 | v4.12,63 v4.12,40 | v21.38,90.5 21.75,90.5 25.88,94.62 43.38,94.62 56.38,107.62 v56.38,110.25
  Bottom 0.152: 12.5,18.75 12.5,15.88 12.62,15.75 13.5,15.75 14.25,16.5 14.25,17 ANDB.15 | 12.5,18.75 14.62,20.88 15.12,20.88 15.88,21.62 27.12,21.62 27.88,22.38 36.38,22.38 v37.12,21.62 | ORB.15 39.25,17.12 39,17.38 v39,18.62 41.88,18.62 42.5,19.25 46.38,19.25 47.25,18.38 55.75,18.38 58.75,15.38 63.12,15.38 64.25,16.5 64.25,17 XORB.15 | SHRB.15 49.38,125.12 49.38,125.88 v50,126.5 54.75,131.25 58.75,131.25 58.88,131.12 64.25,131.12 66,129.38 66,128.88 65.38,128.25 v64.88,128.25 | v72.62,128.12 73,127.75 77.12,127.75 79.25,125.62 79.25,125.12 NOTB.15 79.25,125 79.25,124 v78.75,123.5 | v174.62,80.62 181.25,80.62 182.62,82 | 182.62,82 183.75,83.12 184.12,83.12 185,84 185,91.25 184.38,91.88 | 184.38,91.88 183.62,92.62 v183.62,95.38 | IC27.22 146,5.62 145.5,5.12 145.5,4.62 147.5,2.62 v170.12,2.62 | 192.12,50.38 190.5,50.38 189.25,51.62 185.38,51.62 182.38,54.62 182.38,56 ADDF.15 | 192.12,50.38 v193.38,50.38 | v183.12,81.5 182.62,82 | v186.38,78.25 186.38,66.38 189.75,63 189.75,53.62 192.12,51.25 192.12,50.38 | v112.25,118.38 112.25,118.75 119.5,126 v143,126 | v150.88,127.75 170.25,127.75 185.38,112.62 185.38,92.88 184.38,91.88 | 12.5,18.75 11.5,18.75 v10.5,19.75 | v4,29.5 4,38.88 4.12,39 v4.12,40 | v4.12,63 4.12,70.38 3.38,71.12 3.38,86.38 4.5,87.5 18.38,87.5 v21.38,90.5 | v56.38,110.25 56.38,116.38 52.62,120.12 52.25,120.12 51,121.38 v51,122.75
BUSOUT12  (via drill 0.35)
  Top 0.152: v36.88,19.25 36.88,19.5 35.12,21.25 v35.12,21.62 35.88,22.38 v35.88,24.62 | v60,23.25 v60,21.62 | v51.75,123.38 51.75,124.88 51.88,125 SHLB.14 | v61.62,135.25 61,135.88 60.38,135.88 59.12,134.62 59.12,130.38 58.75,130 v54.88,130 | 172.25,79.62 170.38,81.5 170.38,96 | 172.25,79.62 172.5,79.38 173,79.38 NOTA1.5 172.25,79.62 | 170.38,96 176.12,101.75 176.62,101.75 176.88,102 176.88,104.25 178.25,105.62 180.62,105.62 182.75,107.75 183.25,107.75 183.75,107.25 183.75,103.12 ZERO2.8 | v146.12,4.88 v144.25,6.75 | v174.25,20.25 174.25,24 178.38,28.12 v178.38,32.88 | v184.62,44.38 184.25,44.75 184.25,47.62 v183.88,48 | 172.25,79.62 171.38,78.75 v171.38,74.12 | v70.38,127.12 70.38,116.88 v72.62,114.62 | v76.5,106.75 76.5,104.88 78.38,103 80,103 85,98 108.12,98 116,90.12 v144.88,90.12 | 170.38,96 v169.75,96.62 | v14.5,19.88 14.5,20.25 13.88,20.88 13.88,29.12 16.75,32 v16.75,39.38 | v16.75,47.25 16.75,47.62 19.5,50.38 19.5,56.12 20.38,57 20.38,60.25 19.38,61.25 19.38,70.25 31.25,82.12 v43.25,82.12 | v52.75,91.62 53.12,91.62 71.38,109.88 v73.88,109.88
  Bottom 0.152: 14.62,19.88 16,21.25 27.25,21.25 28,22 34.75,22 v35.12,21.62 | 14.62,19.88 13.12,18.38 13.12,17.12 ANDB.14 | v36.88,19.25 38,18.12 38,17.12 ORB.14 | v60,21.62 63,18.62 63,17.12 XORB.14 | v60,23.25 44.25,23.25 42.88,24.62 v35.88,24.62 | v51.75,123.38 51.25,123.38 | 51.25,123.38 50.75,123.38 50.25,122.88 49.25,122.88 48.12,124 48.12,125 SHRB.14 | 72,127.88 72.5,127.38 75,127.38 76.12,126.25 76.12,124 76.38,123.75 77.25,123.75 78,124.5 78,125 NOTB.14 | 72,127.88 72,130.62 67.38,135.25 v61.62,135.25 | v54.88,130 51.25,126.38 51.25,123.38 | v144.25,6.75 144.25,8 IC27.23 | v146.12,4.88 147,4.88 147.5,4.38 155.88,4.38 160.5,9 160.5,9.75 165.5,14.75 165.5,19 166.75,20.25 v174.25,20.25 | v178.38,32.88 178.38,37 179.75,38.38 180.88,38.38 184.62,42.12 v184.62,44.38 | v183.88,48 183.88,52.12 181.25,54.75 | 181.25,54.75 181.12,54.88 181.12,56 ADDF.14 | v171.38,74.12 171.38,62.75 170.75,62.12 170.75,61.62 171.12,61.25 174.38,61.25 175.5,62.38 176.75,62.38 179.5,59.62 179.5,57.38 179.25,57.12 179.25,54.88 179.38,54.75 181.25,54.75 | 72,127.88 71.12,127.88 v70.38,127.12 | v72.62,114.62 73.88,113.38 v73.88,109.88 73.88,109.38 v76.5,106.75 | v144.88,90.12 144.88,90.5 148.38,94 161.88,94 164.5,96.62 v169.75,96.62 | v14.5,19.88 14.62,19.88 | v16.75,47.25 v16.75,39.38 | v52.75,91.62 v43.25,82.12
BUSOUT13  (via drill 0.35)
  Top 0.152: v9.88,19 4.62,19 3.38,17.75 3.38,9.75 v10.62,2.5 | v25.62,6.88 25.62,8.25 27.12,9.75 | 27.12,9.75 30.75,13.38 33.12,13.38 v34.25,14.5 | v47.75,126.62 49.25,126.62 49.75,127.12 51.5,127.12 53.12,125.5 | 53.12,125.5 53.12,125.12 SHLB.13 53.12,125.5 | v76.75,127.12 76.75,128.25 v76.25,128.75 | v72.5,132 64.38,132 62.38,130 60.75,130 57.12,126.38 54,126.38 53.12,125.5 | v141.88,9.75 141.88,13.5 138.88,16.5 138.88,18.25 | 138.88,18.25 151,30.38 v167.5,30.38 | 138.88,18.25 134.62,22.5 91.88,22.5 90.62,23.75 69.12,23.75 66.88,21.5 64.88,21.5 62.25,18.88 v61.88,18.88 60.62,18.88 59.88,18.12 59.88,16 60.12,15.75 v60.12,13.5 | 175.62,78 173.12,78 NOTA1.4 | 175.62,78 179.62,74 179.62,59.88 v180.12,59.38 | v182.62,99.88 182.62,103 ZERO2.9 182.62,103.12 183,103.5 v183,107.12 | v180.62,89 v184.38,92.75 | v178.62,87 177.88,87 176,85.12 176,78.38 175.62,78 | v75.12,130.62 80.88,130.62 85.75,135.5 89.5,135.5 89.62,135.62 115.38,135.62 116.62,134.38 122,134.38 v122.62,135 | 27.12,9.75 33,3.88 v46.75,3.88
  Bottom 0.152: v9.88,19 10.38,19 11.75,17.62 11.75,17.12 ANDB.13 | v10.62,2.5 14.5,2.5 14.75,2.75 19.62,2.75 23.75,6.88 v25.62,6.88 | v34.25,14.5 34.62,14.5 35.5,15.38 36.12,15.38 36.75,16 36.75,17 ORB.13 | v47.75,126.62 46.88,125.75 46.88,125.12 SHRB.13 | v76.75,127.12 76.75,125.12 NOTB.13 | 74.75,130.25 73,132 v72.5,132 | 74.75,130.25 v76.25,128.75 | v141.88,9.75 142.75,8.88 144.12,8.88 IC27.24 | v167.5,30.38 168.25,30.38 174.88,37 177.88,37 179.62,38.75 180.75,38.75 184,42 184,44.62 184.25,44.88 184.25,47.5 184.5,47.75 184.5,52 181.75,54.75 181.75,57.12 181.5,57.38 180.75,57.38 | 180.75,57.38 179.88,56.5 179.88,56.12 ADDF.13 | v61.88,18.88 61.88,17.12 XORB.13 | v180.12,59.38 180.12,58 180.75,57.38 | v182.62,99.88 184.38,98.12 v184.38,92.75 | v178.62,87 v180.62,89 | v75.12,130.62 74.75,130.25 | v122.62,135 136.38,135 145.25,126.12 147.25,126.12 147.38,126.25 171.25,126.25 183,114.5 v183,107.12 | v46.75,3.88 46.75,4.25 55.38,12.88 55.38,13.12 55.75,13.5 v60.12,13.5
BUSOUT14  (via drill 0.35)
  Top 0.152: v45.75,19.88 45.12,20.5 44.25,20.5 v43.75,20 | v46.38,122.88 49,122.88 50.88,121 52,121 54.38,123.38 | 54.38,123.38 54.38,125 SHLB.12 | v58.62,123.25 60.88,123.25 66.12,128.5 69.88,128.5 v71.38,127 71.38,123.62 71.25,123.5 71.25,123 v73.12,121.12 | 54.38,123.38 v54.5,123.25 | v142.88,9.75 142.88,13 139.25,16.62 139.25,17.75 v150.5,29 | v162.12,44.88 164.25,44.88 173.5,54.12 173.5,55.88 v174,56.38 | v175.75,61.75 175.75,66.75 178,69 178,74.25 177.62,74.62 177.25,74.62 175.12,76.75 173.12,76.75 NOTA1.3 | ZERO2.11 180,102.5 175.38,97.88 v175.38,95.62 | v151.38,78 153,78 159.75,71.25 v165,71.25 | v84,119.25 84.88,119.25 91.75,112.38 94.62,112.38 v97.12,109.88 | v105.62,101 122.38,101 132,91.38 147.75,91.38 v147.88,91.25 | v26.5,19.12 26.5,25.75 27.12,26.38 27.12,30.25 22.12,35.25 22.12,38.62 25.62,42.12 26.75,42.12 28.62,44 28.62,46.25 v32.62,50.25 | v54.38,51.75 54.38,52.25 57.5,55.38 v57.5,66
  Bottom 0.152: 28.38,20.12 28.88,20.12 29.25,19.75 32.12,19.75 32.25,19.88 35.25,19.88 35.88,19.25 | 28.38,20.12 19.5,20.12 17.5,18.12 17.5,15.88 17,15.38 11.75,15.38 10.62,16.5 10.62,17 ANDB.12 | 35.88,19.25 36.12,19 36.12,18.5 35.62,18 35.62,17.12 ORB.12 | v45.75,19.88 58.12,19.88 60.5,17.5 60.5,17.12 XORB.12 | v43.75,20 42.75,20 42.12,19.38 37.62,19.38 37.12,19.88 36.5,19.88 35.88,19.25 | v46.38,122.88 45.62,123.62 45.62,125 SHRB.12 | v71.38,127 74,127 75.5,125.5 75.5,125.12 NOTB.12 | v54.5,123.25 v58.62,123.25 | v142.88,9.75 143,9.62 144.12,9.62 IC27.25 | v150.5,29 158.88,29 162.12,32.25 v162.12,44.88 | v175.75,61.75 176.25,61.75 178.25,59.75 178.25,56.38 178.5,56.12 ADDF.12 178.5,56 178.5,55.5 177.75,54.75 176.88,54.75 175.25,56.38 v174,56.38 173.75,56.62 173.75,57.62 165,66.38 v165,71.25 | v175.38,95.62 175.38,95.25 171.88,91.75 164.62,91.75 159.12,86.25 | 159.12,86.25 156.88,84 156.5,84 151.38,78.88 v151.38,78 | v73.12,121.12 73.5,121.12 74.38,120.25 76.25,120.25 76.62,120.62 82.62,120.62 v84,119.25 | v105.62,101 97.12,109.5 | v147.88,91.25 151.75,91.25 156.12,86.88 158.5,86.88 159.12,86.25 | 28.38,20.12 28.38,19.25 28,18.88 26.75,18.88 v26.5,19.12 | v32.62,50.25 49.62,50.25 51.12,51.75 v54.38,51.75 | v57.5,66 57.5,76.62 89.12,108.25 95.5,108.25 96.75,109.5 97.12,109.5 | 97.12,109.5 v97.12,109.88
BUSOUT15  (via drill 0.35)
  Top 0.152: v66.5,130.38 65.25,130.38 64.5,129.62 60.88,129.62 56.38,125.12 55.75,125.12 SHLB.11 55.62,125 55.62,120.38 v55.25,120 | v131.75,112.25 128.38,112.25 127.38,111.25 127.38,110.12 IC51.13 127.25,110 127.25,109 126.75,108.5 126.75,102.88 126.5,102.62 125.62,102.62 125.5,102.75 125.5,105 125,105.5 v119.62,105.5 | v178.5,104.62 178.5,103.25 178.62,103.12 ZERO2.12 | v69.62,106.38 69.62,103.88 95.5,78 v107.88,78 | v170.75,71.25 172.62,71.25 173.12,70.75 173.62,70.75 175,72.12 175,74.5 174,75.5 173.12,75.5 NOTA1.2 | v67,23.12 66.12,23.12 65.25,22.25 63.88,22.25 v61.12,19.5 | v32.88,18.88 32.88,20 33.12,20.25 33.12,23.12 v32.88,23.38 | v174.38,57.5 173.88,57 173.75,57 171.75,55 171.75,54.75 165,48 162,48 156.25,42.25 156.25,40.88 v154.25,38.88 | v119,84.5 140,84.5 v141.88,82.62 | v154.75,74.12 155.38,74.12 159.88,69.62 v169.12,69.62
  Bottom 0.152: v66.5,130.38 66.5,130.12 71.5,125.12 74.25,125.12 NOTB.11 | v131.75,112.25 157.38,112.25 159.5,110.12 173,110.12 v178.5,104.62 | v55.25,120 55.25,118 66.88,106.38 v69.62,106.38 | v107.88,78 107.88,78.38 116.5,87 | 116.5,87 119.62,90.12 v119.62,105.5 | 170.75,69 170.75,62.62 170.38,62.25 170.38,61.5 v174.38,57.5 175.12,56.75 175.5,56.75 176.12,56.12 177.25,56.12 ADDF.11 | 170.75,69 v170.75,71.25 | 120.25,2.5 92,2.5 82.75,11.75 82.75,12.25 75.25,19.75 70.38,19.75 v67,23.12 | 120.25,2.5 132.88,2.5 140.75,10.38 144.12,10.38 IC27.26 | XORB.11 59.38,17 59.38,16.5 60.12,15.75 61,15.75 61.12,15.88 v61.12,19.5 59.38,21.25 45.75,21.25 43.88,23.12 32.88,23.12 | 32.88,23.12 27.62,23.12 26.88,22.38 15.62,22.38 15.38,22.12 12,22.12 9.25,19.38 9.25,17.12 ANDB.11 | v32.88,18.88 34.25,17.5 34.25,17.12 ORB.11 | 32.88,23.12 v32.88,23.38 | v154.25,38.88 154.25,38.5 132.12,16.38 121.25,16.38 121.12,16.5 120.62,16.5 120.25,16.12 120.25,2.5 | v119,84.5 116.5,87 | v141.88,82.62 141.88,81 148.75,74.12 v154.75,74.12 | v169.12,69.62 169.75,69 170.75,69
C  (via drill 0.35)
  Top 0.152: v155.5,21.12 155.88,21.12 157.25,22.5 v172.38,22.5 | v175,22.25 175,20.38 175.62,19.75 175.62,16.88 v176.88,15.62
  Bottom 0.152: v155.5,21.12 155,20.62 149,20.62 146.88,18.5 146.88,17.88 IC27.35 | v172.38,22.5 173.12,22.5 173.38,22.25 v175,22.25 | v176.88,15.62 178.25,14.25 179.38,14.25 RN2.18
CARRY_OUT
  Top 0.152: IC51.5 128.75,104 128.75,107.12 130.5,108.88 130.5,111.12 131,111.62 132,111.62 132.38,112 132.38,122.62 129.88,125.12 129.88,128.25 148.62,147 LED1.A 148.75,147 149.75,146 160.88,146 162.88,148 FLAGS.3
CLEAR  (via drill 0.35)
  Top 0.152: v125.5,108.5 124.88,109.12 124.88,110 IC51.15 | v132.88,107.5 132.88,107.88 154.25,129.25 171.12,129.25 v182.62,140.75
  Bottom 0.152: v125.5,108.5 127.88,108.5 128.88,107.5 v132.88,107.5 | v182.62,140.75 189.88,148 VCC_GND.4
CLK  (via drill 0.35)
  Top 0.152: v182.62,143.38 181.12,143.38 176.75,139 176.75,137.38 169,129.62 154.12,129.62 131.25,106.75 131.25,104 IC51.7
  Bottom 0.152: v182.62,143.38 187.25,148 VCC_GND.3
D  (via drill 0.35)
  Top 0.152: v154.75,21.88 156.12,21.88 157.38,23.12 v171.12,23.12 | v173.62,22.88 173.62,18 v177.88,13.75
  Bottom 0.152: IC27.34 146,18.38 148.62,21 153.88,21 v154.75,21.88 | v171.12,23.12 173.38,23.12 v173.62,22.88 | v177.88,13.75 178.12,13.75 178.88,13 179.38,13 RN2.17
DIG0  (via drill 0.35)
  Top 0.152: v156.12,19.12 159.38,19.12 U$1.PIN14
  Bottom 0.152: v156.12,19.12 155.62,19.62 152,19.62 150.88,18.5 150.88,17.88 IC27.40
DIG1  (via drill 0.35)
  Top 0.152: v155.12,19 155.38,19 156.12,18.25 166.25,18.25 167,19 U$1.PIN11
  Bottom 0.152: v155.12,19 152.25,19 151.62,18.38 151.62,17.88 IC27.41
DIG2  (via drill 0.35)
  Top 0.152: v152.5,15.62 156.75,11.38 162,11.38 169.62,19 U$1.PIN10
  Bottom 0.152: v152.5,15.62 152.5,17.75 IC27.42
DIG3  (via drill 0.35)
  Top 0.152: v153.25,14 153.62,14 158.12,9.5 v161.12,9.5
  Bottom 0.152: v153.25,14 153.25,17.75 IC27.43 | v161.12,9.5 161.12,8.75 166.25,3.62 166.25,3.25 166.5,3 167.75,3 168.75,4 168.75,4.5 169,4.75 171.38,4.75 172.12,4 U$1.PIN6
DP  (via drill 0.35)
  Top 0.152: v145.62,20.12 155.88,20.12 157.25,21.5 168.75,21.5 171.38,18.88 v171.38,16.88 | v174.75,13.5 v173.88,14.38
  Bottom 0.152: v145.62,20.12 141.75,16.25 141.75,15.25 143.38,13.62 144.12,13.62 IC27.30 | v173.88,14.38 v171.38,16.88 | v174.75,13.5 174.75,12.12 179,7.88 179.38,7.88 RN2.13
E  (via drill 0.35)
  Top 0.152: v142.38,16 141,16 140,17 140,17.5 147.12,24.62 v168,24.62 | v178.75,19.38 178.75,15.88 v180.88,13.75
  Bottom 0.152: v142.38,16 IC27.33 | v168,24.62 173.5,24.62 v178.75,19.38 | v180.88,13.75 180.88,12.75 179.88,11.75 179.5,11.75 RN2.16
F  (via drill 0.35)
  Top 0.152: v142.88,15.12 145.38,15.12 v148.62,11.88 | v151.88,9 154,9 154.25,8.75 155.25,8.75 155.38,8.88 163.5,8.88 v165.75,11.12 | v177.88,11.12 v170.62,11.12
  Bottom 0.152: v142.88,15.12 144.12,15.12 IC27.32 | v148.62,11.88 149,11.88 v151.88,9 | v170.62,11.12 v165.75,11.12 | v177.88,11.12 178.25,11.12 179,10.38 RN2.15
G  (via drill 0.35)